# Altium schematic sheet RaspComputeModule_4_IO.SchDoc
size A1
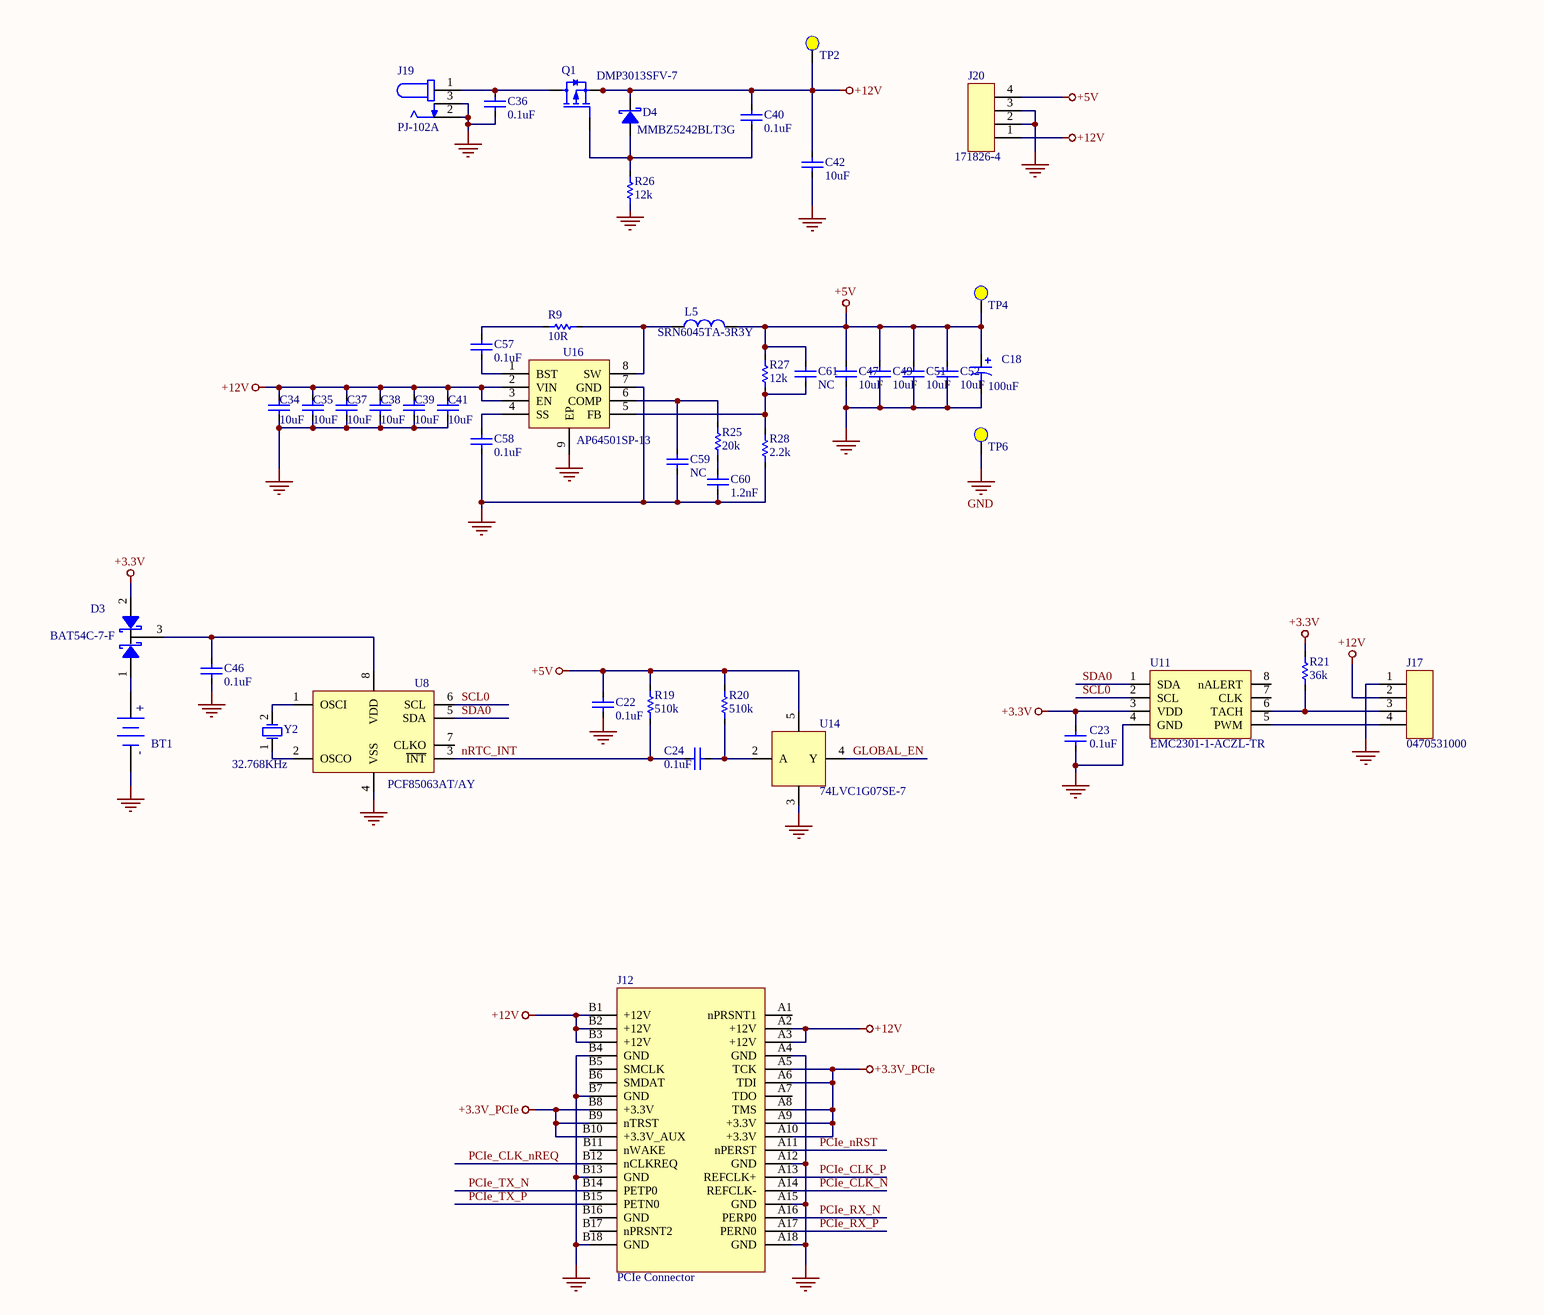
[diagram p0: RaspComputeModule_4_IO.SchDoc, top left]
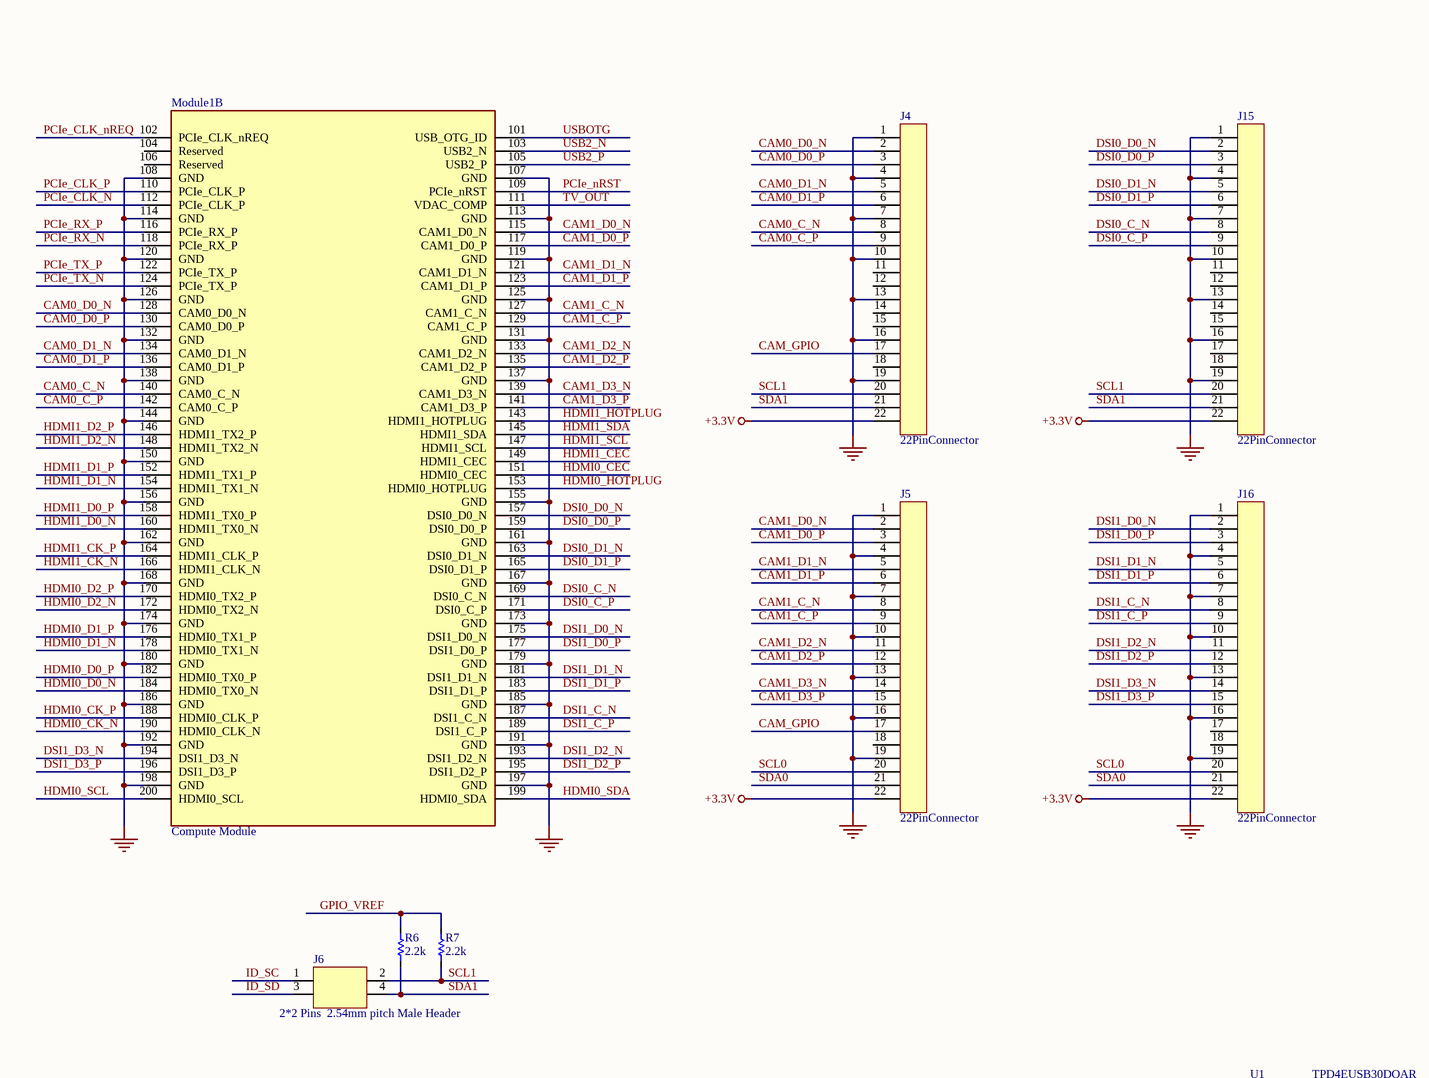
[diagram p1: RaspComputeModule_4_IO.SchDoc, top right]
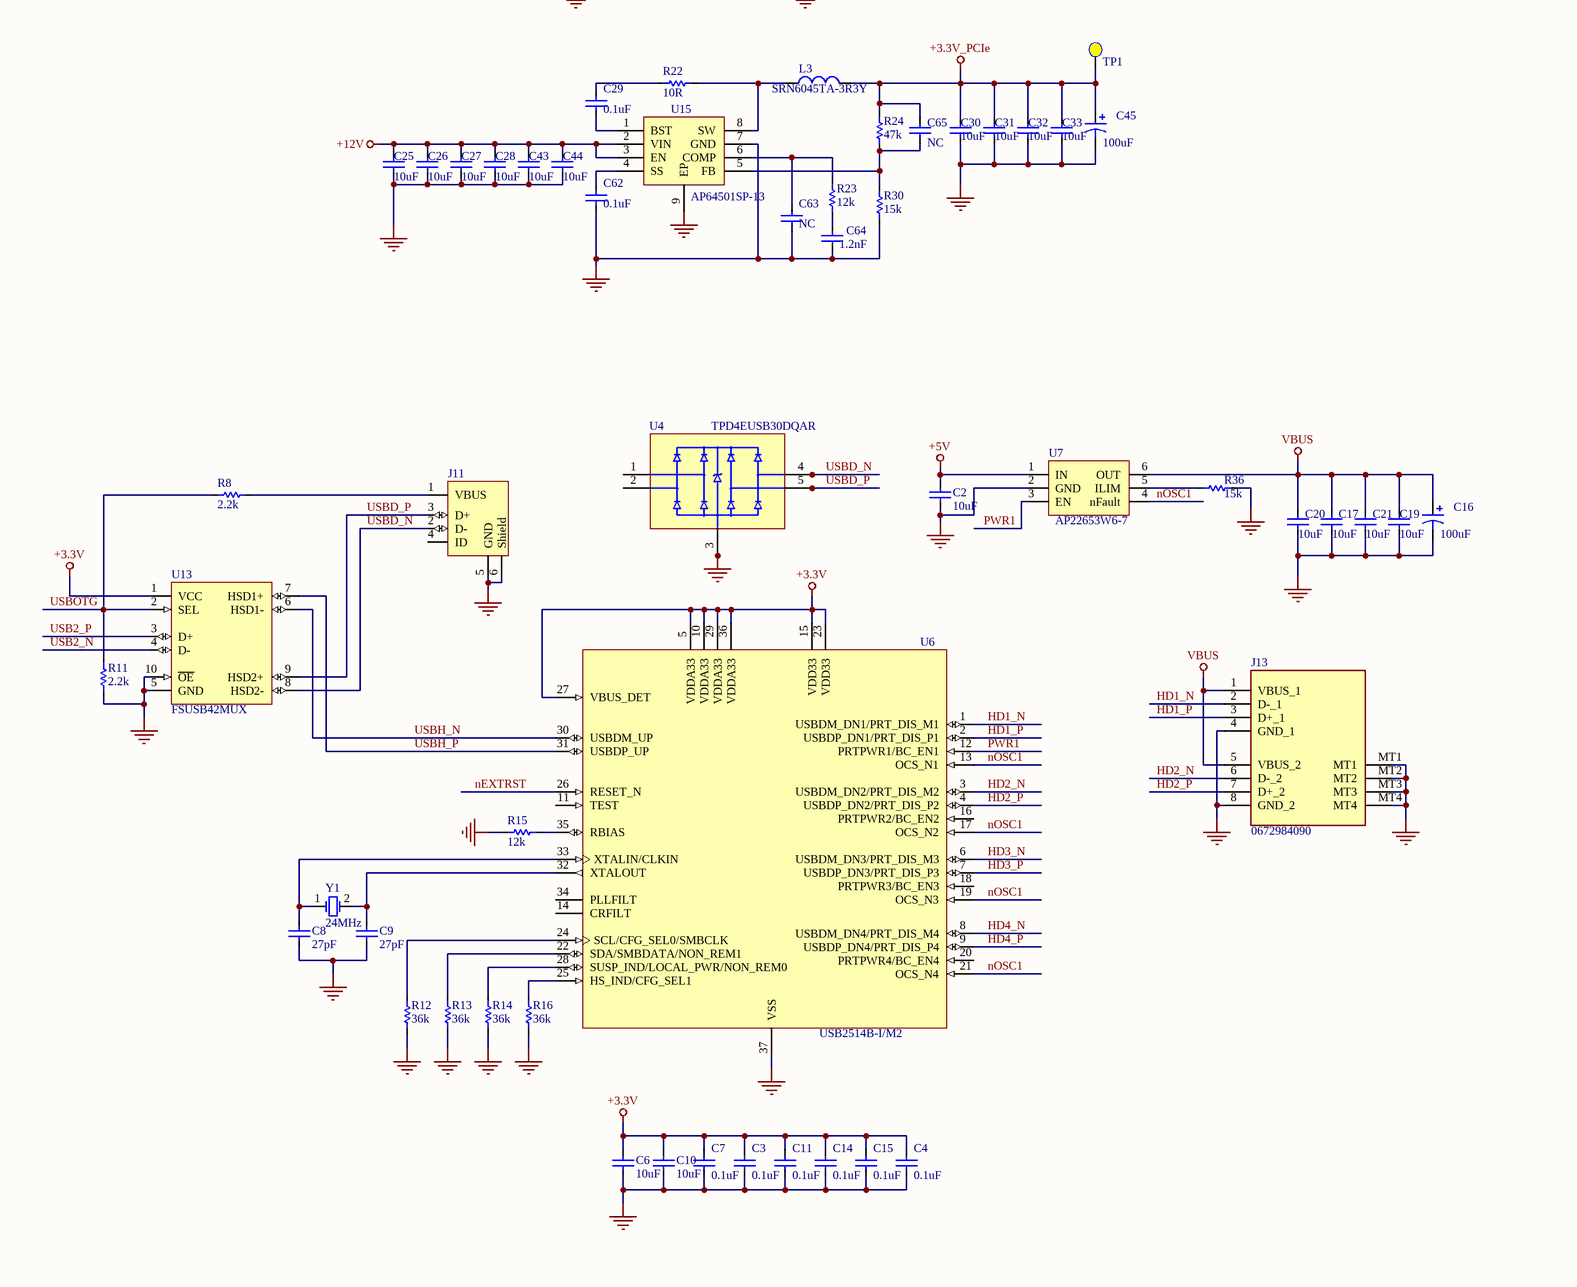
[diagram p2: RaspComputeModule_4_IO.SchDoc, bottom left]
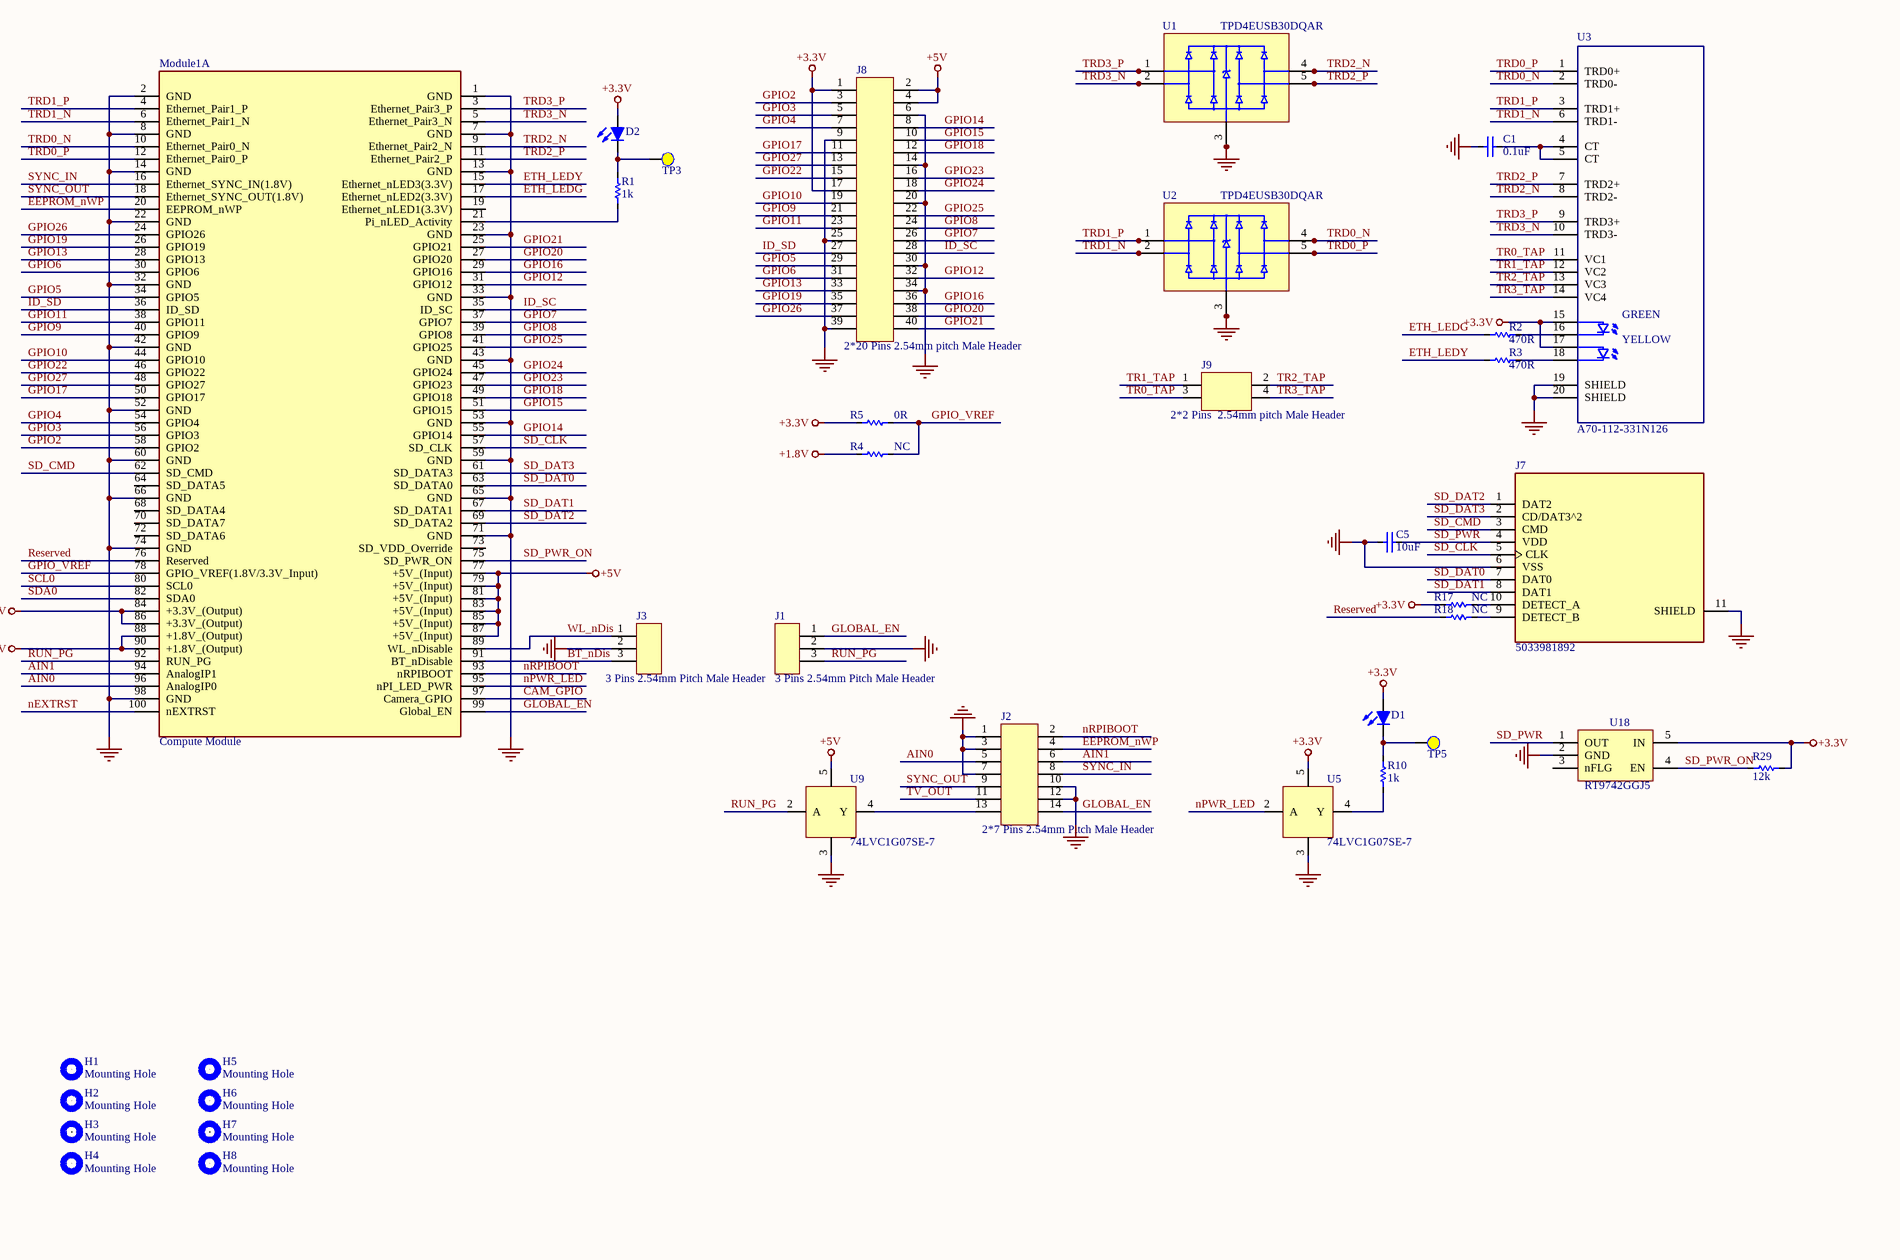
[diagram p3: RaspComputeModule_4_IO.SchDoc, bottom right]

## Parts
BT1  3034  [BatteryHolder_Keystone_3034_1x20mm]  (value not drawn)
C1  0.1uF  [C_0402_1005Metric]
C2  10uF  [C_0805_2012Metric]
C3  0.1uF  [C_0402_1005Metric]
C4  0.1uF  [C_0402_1005Metric]
C5  10uF  [C_0805_2012Metric]
C6  10uF  [C_0805_2012Metric]
C7  0.1uF  [C_0402_1005Metric]
C8  27pF  [C_0402_1005Metric]
C9  27pF  [C_0402_1005Metric]
C10  10uF  [C_0805_2012Metric]
C11  0.1uF  [C_0402_1005Metric]
C14  0.1uF  [C_0402_1005Metric]
C15  0.1uF  [C_0402_1005Metric]
C16  100uF  [CP_EIA-7343-31_Kemet-D]
C17  10uF  [C_0805_2012Metric]
C18  100uF  [CP_EIA-7343-31_Kemet-D]
C19  10uF  [C_0805_2012Metric]
C20  10uF  [C_0805_2012Metric]
C21  10uF  [C_0805_2012Metric]
C22  0.1uF  [C_0402_1005Metric]
C23  0.1uF  [C_0402_1005Metric]
C24  0.1uF  [C_0402_1005Metric]
C25  10uF  [C_0805_2012Metric]
C26  10uF  [C_0805_2012Metric]
C27  10uF  [C_0805_2012Metric]
C28  10uF  [C_0805_2012Metric]
C29  0.1uF  [C_0402_1005Metric]
C30  10uF  [C_0805_2012Metric]
C31  10uF  [C_0805_2012Metric]
C32  10uF  [C_0805_2012Metric]
C33  10uF  [C_0805_2012Metric]
C34  10uF  [C_0805_2012Metric]
C35  10uF  [C_0805_2012Metric]
C36  0.1uF  [C_0402_1005Metric]
C37  10uF  [C_0805_2012Metric]
C38  10uF  [C_0805_2012Metric]
C39  10uF  [C_0805_2012Metric]
C40  0.1uF  [C_0402_1005Metric]
C41  10uF  [C_0805_2012Metric]
C42  10uF  [C_0805_2012Metric]
C43  10uF  [C_0805_2012Metric]
C44  10uF  [C_0805_2012Metric]
C45  100uF  [CP_EIA-7343-31_Kemet-D]
C46  0.1uF  [C_0402_1005Metric]
C47  10uF  [C_0805_2012Metric]
C49  10uF  [C_0805_2012Metric]
C51  10uF  [C_0805_2012Metric]
C52  10uF  [C_0805_2012Metric]
C57  0.1uF  [C_0402_1005Metric]
C58  0.1uF  [C_0402_1005Metric]
C59  NC  [C_0402_1005Metric]
C60  1.2nF  [C_0402_1005Metric]
C61  NC  [C_0402_1005Metric]
C62  0.1uF  [C_0402_1005Metric]
C63  NC  [C_0402_1005Metric]
C64  1.2nF  [C_0402_1005Metric]
C65  NC  [C_0402_1005Metric]
D1  SML-D12U1WT86  [LED_0603_1608Metric]  (value not drawn)
D2  SML-D12U1WT86  [LED_0603_1608Metric]  (value not drawn)
D3  BAT54C-7-F  [SOT-23]
D4  MMBZ5242BLT3G  [D_SOT-23_ANK]
H1  Mounting Hole  [MountingHole_2.7mm_M2.5]
H2  Mounting Hole  [MountingHole_2.7mm_M2.5]
H3  Mounting Hole  [MountingHole_2.7mm_M2.5]
H4  Mounting Hole  [MountingHole_2.7mm_M2.5]
H5  Mounting Hole  [MountingHole_2.7mm_M2.5]
H6  Mounting Hole  [MountingHole_2.7mm_M2.5]
H7  Mounting Hole  [MountingHole_2.7mm_M2.5]
H8  Mounting Hole  [MountingHole_2.7mm_M2.5]
J1  3 Pins 2.54mm Pitch Male Header  [PinHeader_1x03_P2.54mm_Vertical]
J2  2*7 Pins 2.54mm Pitch Male Header  [PinHeader_2x07_P2.54mm_Vertical]
J3  3 Pins 2.54mm Pitch Male Header  [PinHeader_1x03_P2.54mm_Vertical]
J4  22PinConnector  [Hirose_FH12-22S-0.5SH_1x22-1MP_P0.50mm_Horizontal]
J5  22PinConnector  [Hirose_FH12-22S-0.5SH_1x22-1MP_P0.50mm_Horizontal]
J6  2*2 Pins  2.54mm pitch Male Header  [PinHeader_2x02_P2.54mm_Vertical]
J7  5033981892  [SDCARD_MOLEX_503398-1892]
J8  2*20 Pins 2.54mm pitch Male Header  [PinHeader_2x20_P2.54mm_Vertical]
J9  2*2 Pins  2.54mm pitch Male Header  [PinHeader_2x02_P2.54mm_Vertical]
J11  10118194-0001LF  [10118194-0001LF]  (value not drawn)
J12  PCIe Connector  [PCIex1-36]
J13  0672984090  [MOLEX_USB_67298-4090]
J15  22PinConnector  [Hirose_FH12-22S-0.5SH_1x22-1MP_P0.50mm_Horizontal]
J16  22PinConnector  [Hirose_FH12-22S-0.5SH_1x22-1MP_P0.50mm_Horizontal]
J17  0470531000  [FanPinHeader_1x04_P2.54mm_Vertical]
J19  PJ-102A  [CUI_PJ-102A]
J20  171826-4  [TE_171826-4]
L3  SRN6045TA-3R3Y  [L_Bourns_SRN6045TA]
L5  SRN6045TA-3R3Y  [L_Bourns_SRN6045TA]
Module1  Compute Module  [Raspberry-Pi-4-Compute-Module]  (parts A,B of 2)
Q1  DMP3013SFV-7  [Diodes_PowerDI3333-8]
R1  1k  [R_0402_1005Metric]
R2  470R  [R_0402_1005Metric]
R3  470R  [R_0402_1005Metric]
R4  NC  [R_0402_1005Metric]
R5  0R  [R_0402_1005Metric]
R6  2.2k  [R_0402_1005Metric]
R7  2.2k  [R_0402_1005Metric]
R8  2.2k  [R_0402_1005Metric]
R9  10R  [R_0402_1005Metric]
R10  1k  [R_0402_1005Metric]
R11  2.2k  [R_0402_1005Metric]
R12  36k  [R_0402_1005Metric]
R13  36k  [R_0402_1005Metric]
R14  36k  [R_0402_1005Metric]
R15  12k  [R_0402_1005Metric]
R16  36k  [R_0402_1005Metric]
R17  NC  [R_0402_1005Metric]
R18  NC  [R_0402_1005Metric]
R19  510k  [R_0402_1005Metric]
R20  510k  [R_0402_1005Metric]
R21  36k  [R_0402_1005Metric]
R22  10R  [R_0402_1005Metric]
R23  12k  [R_0402_1005Metric]
R24  47k  [R_0402_1005Metric]
R25  20k  [R_0402_1005Metric]
R26  12k  [R_0402_1005Metric]
R27  12k  [R_0402_1005Metric]
R28  2.2k  [R_0402_1005Metric]
R29  12k  [R_0402_1005Metric]
R30  15k  [R_0402_1005Metric]
R36  15k  [R_0402_1005Metric]
TP1  testpoint  [TestPoint_Pad_2.0x2.0mm]  (value not drawn)
TP2  testpoint  [TestPoint_Pad_2.0x2.0mm]  (value not drawn)
TP3  testpoint  [TestPoint_Pad_2.0x2.0mm]  (value not drawn)
TP4  testpoint  [TestPoint_Pad_2.0x2.0mm]  (value not drawn)
TP5  testpoint  [TestPoint_Pad_2.0x2.0mm]  (value not drawn)
TP6  testpoint  [TestPoint_Pad_2.0x2.0mm]  (value not drawn)
U1  TPD4EUSB30DQAR  [USON-10_2.5x1.0mm_P0.5mm]
U2  TPD4EUSB30DQAR  [USON-10_2.5x1.0mm_P0.5mm]
U3  A70-112-331N126  [TRJG0926HENL]
U4  TPD4EUSB30DQAR  [USON-10_2.5x1.0mm_P0.5mm]
U5  74LVC1G07SE-7  [SOT-353_SC-70-5]
U6  USB2514B-I/M2  [QFN-36-1EP_6x6mm_P0.5mm_EP3.7x3.7mm]
U7  AP22653W6-7  [SOT-23-6]
U8  PCF85063AT/AY  [SOIC-8_3.9x4.9mm_P1.27mm]
U9  74LVC1G07SE-7  [SOT-353_SC-70-5]
U11  EMC2301-1-ACZL-TR  [MSOP-8_3x3mm_P0.65mm]
U13  FSUSB42MUX  [MSOP-10_3x3mm_P0.5mm]
U14  74LVC1G07SE-7  [SOT-353_SC-70-5]
U15  AP64501SP-13  [SOIC-8-1EP_3.9x4.9mm_P1.27mm_EP2.95x4.9mm_Mask2.71x3.4mm_ThermalVias]
U16  AP64501SP-13  [SOIC-8-1EP_3.9x4.9mm_P1.27mm_EP2.95x4.9mm_Mask2.71x3.4mm_ThermalVias]
U18  RT9742GGJ5  [SOT-23-5]
Y1  24MHz  [Crystal_SMD_HC49-SD]
Y2  32.768KHz  [Crystal_SMD_3215-2Pin_3.2x1.5mm]

## Nets
+1.8V: Module1.88(+1.8V_(Output)) Module1.90(+1.8V_(Output)) R4.1
+3.3V: C3.1 C4.1 C6.1 C7.1 C10.1 C11.1 C14.1 C15.1 C23.1 D1.2(A) D2.2(A) D3.2 J4.22 J5.22 J8.1 J8.17 J15.22 J16.22 Module1.84(+3.3V_(Output)) Module1.86(+3.3V_(Output)) R5.1 R17.1 R21.2 R29.1 U3.15(G_A) U3.17(Y_A) U5.5(VCC) U6.5(VDDA33) U6.10(VDDA33) U6.15(VDD33) U6.23(VDD33) U6.27(VBUS_DET) U6.29(VDDA33) U6.36(VDDA33) U11.3(VDD) U13.1(VCC) U18.5(IN)
+3.3V_PCIe: C30.1 C31.1 C32.1 C33.1 C45.1 C65.1 J12.A5(TCK) J12.A6(TDI) J12.A8(TMS) J12.A9(+3.3V) J12.A10(+3.3V) J12.B8(+3.3V) J12.B9(nTRST) J12.B10(+3.3V_AUX) L3.2 R24.1 TP1.1
+5V: C2.1 C18.1 C22.1 C47.1 C49.1 C51.1 C52.1 C61.1 J8.2 J8.4 J20.4 L5.2 Module1.77(+5V_(Input)) Module1.79(+5V_(Input)) Module1.81(+5V_(Input)) Module1.83(+5V_(Input)) Module1.85(+5V_(Input)) Module1.87(+5V_(Input)) R19.2 R20.2 R27.1 TP4.1 U7.1(IN) U9.5(VCC) U14.5(VCC)
+12V: C25.1 C26.1 C27.1 C28.1 C34.1 C35.1 C37.1 C38.1 C39.1 C40.1 C41.1 C42.1 C43.1 C44.1 D4.1(K) J12.A2(+12V) J12.A3(+12V) J12.B1(+12V) J12.B2(+12V) J12.B3(+12V) J17.2 J20.1 Q1.1(S) Q1.2(S) Q1.3(S) TP2.1 U15.2(VIN) U15.3(EN) U16.2(VIN) U16.3(EN)
GND: BT1.2(-) C1.2 C2.2 C3.2 C4.2 C5.2 C6.2 C7.2 C8.2 C9.2 C10.2 C11.2 C14.2 C15.2 C16.2 C17.2 C18.2 C19.2 C20.2 C21.2 C22.2 C23.2 C25.2 C26.2 C27.2 C28.2 C30.2 C31.2 C32.2 C33.2 C34.2 C35.2 C36.2 C37.2 C38.2 C39.2 C41.2 C42.2 C43.2 C44.2 C45.2 C46.2 C47.2 C49.2 C51.2 C52.2 C58.2 C59.2 C60.2 C62.2 C63.2 C64.2 J1.2 J2.1 J2.3 J2.7 J2.10 J2.12 J3.2 J4.1 J4.4 J4.7 J4.10 J4.13 J4.16 J4.19 J5.1 J5.4 J5.7 J5.10 J5.13 J5.16 J5.19 J7.6(VSS) J7.11(SHIELD) J8.6 J8.9 J8.14 J8.20 J8.25 J8.30 J8.34 J8.39 J11.5(GND) J11.6(Shield) J12.A4(GND) J12.A12(GND) J12.A15(GND) J12.A18(GND) J12.B4(GND) J12.B7(GND) J12.B13(GND) J12.B18(GND) J13.4(GND_1) J13.8(GND_2) J13.MT1 J13.MT2 J13.MT3 J13.MT4 J15.1 J15.4 J15.7 J15.10 J15.13 J15.16 J15.19 J16.1 J16.4 J16.7 J16.10 J16.13 J16.16 J16.19 J17.1 J19.2 J19.3 J20.2 J20.3 Module1.1(GND) Module1.2(GND) Module1.7(GND) Module1.8(GND) Module1.13(GND) Module1.14(GND) Module1.22(GND) Module1.23(GND) Module1.32(GND) Module1.33(GND) Module1.42(GND) Module1.43(GND) Module1.52(GND) Module1.53(GND) Module1.59(GND) Module1.60(GND) Module1.65(GND) Module1.66(GND) Module1.71(GND) Module1.74(GND) Module1.98(GND) Module1.107(GND) Module1.108(GND) Module1.113(GND) Module1.114(GND) Module1.119(GND) Module1.120(GND) Module1.125(GND) Module1.126(GND) Module1.131(GND) Module1.132(GND) Module1.137(GND) Module1.138(GND) Module1.144(GND) Module1.150(GND) Module1.155(GND) Module1.156(GND) Module1.161(GND) Module1.162(GND) Module1.167(GND) Module1.168(GND) Module1.173(GND) Module1.174(GND) Module1.179(GND) Module1.180(GND) Module1.185(GND) Module1.186(GND) Module1.191(GND) Module1.192(GND) Module1.197(GND) Module1.198(GND) R11.2 R12.2 R13.2 R14.2 R15.1 R16.2 R26.2 R28.2 R30.2 R36.2 TP6.1 U1.3(GND_3) U1.8(GND_8) U2.3(GND_3) U2.8(GND_8) U3.19(SHIELD) U3.20(SHIELD) U4.3(GND_3) U4.8(GND_8) U5.3(GND) U6.37(VSS) U7.2(GND) U8.4(VSS) U9.3(GND) U11.4(GND) U13.5(GND) U13.10(~{OE}) U14.3(GND) U15.7(GND) U15.9(EP) U16.7(GND) U16.9(EP) U18.2(GND)
VBUS: C16.1 C17.1 C19.1 C20.1 C21.1 J13.1(VBUS_1) J13.5(VBUS_2) U7.6(OUT)
AIN0: J2.5 Module1.96(AnalogIP0)
AIN1: J2.6 Module1.94(AnalogIP1)
BT_nDis: J3.3 Module1.91(BT_nDisable)
CAM0_C_N: J4.8 Module1.140(CAM0_C_N)
CAM0_C_P: J4.9 Module1.142(CAM0_C_P)
CAM0_D0_N: J4.2 Module1.128(CAM0_D0_N)
CAM0_D0_P: J4.3 Module1.130(CAM0_D0_P)
CAM0_D1_N: J4.5 Module1.134(CAM0_D1_N)
CAM0_D1_P: J4.6 Module1.136(CAM0_D1_P)
CAM1_C_N: J5.8 Module1.127(CAM1_C_N)
CAM1_C_P: J5.9 Module1.129(CAM1_C_P)
CAM1_D0_N: J5.2 Module1.115(CAM1_D0_N)
CAM1_D0_P: J5.3 Module1.117(CAM1_D0_P)
CAM1_D1_N: J5.5 Module1.121(CAM1_D1_N)
CAM1_D1_P: J5.6 Module1.123(CAM1_D1_P)
CAM1_D2_N: J5.11 Module1.133(CAM1_D2_N)
CAM1_D2_P: J5.12 Module1.135(CAM1_D2_P)
CAM1_D3_N: J5.14 Module1.139(CAM1_D3_N)
CAM1_D3_P: J5.15 Module1.141(CAM1_D3_P)
CAM_GPIO: J4.17 J5.17 Module1.97(Camera_GPIO)
DSI0_C_N: J15.8 Module1.169(DSI0_C_N)
DSI0_C_P: J15.9 Module1.171(DSI0_C_P)
DSI0_D0_N: J15.2 Module1.157(DSI0_D0_N)
DSI0_D0_P: J15.3 Module1.159(DSI0_D0_P)
DSI0_D1_N: J15.5 Module1.163(DSI0_D1_N)
DSI0_D1_P: J15.6 Module1.165(DSI0_D1_P)
DSI1_C_N: J16.8 Module1.187(DSI1_C_N)
DSI1_C_P: J16.9 Module1.189(DSI1_C_P)
DSI1_D0_N: J16.2 Module1.175(DSI1_D0_N)
DSI1_D0_P: J16.3 Module1.177(DSI1_D0_P)
DSI1_D1_N: J16.5 Module1.181(DSI1_D1_N)
DSI1_D1_P: J16.6 Module1.183(DSI1_D1_P)
DSI1_D2_N: J16.11 Module1.193(DSI1_D2_N)
DSI1_D2_P: J16.12 Module1.195(DSI1_D2_P)
DSI1_D3_N: J16.14 Module1.194(DSI1_D3_N)
DSI1_D3_P: J16.15 Module1.196(DSI1_D3_P)
EEPROM_nWP: J2.4 Module1.20(EEPROM_nWP)
ETH_LEDG: Module1.17(Ethernet_nLED2(3.3V)) R2.2
ETH_LEDY: Module1.15(Ethernet_nLED3(3.3V)) R3.2
GLOBAL_EN: J1.1 J2.14 Module1.99(Global_EN) U14.4(Y)
GPIO2: J8.3 Module1.58(GPIO2)
GPIO3: J8.5 Module1.56(GPIO3)
GPIO4: J8.7 Module1.54(GPIO4)
GPIO5: J8.29 Module1.34(GPIO5)
GPIO6: J8.31 Module1.30(GPIO6)
GPIO7: J8.26 Module1.37(GPIO7)
GPIO8: J8.24 Module1.39(GPIO8)
GPIO9: J8.21 Module1.40(GPIO9)
GPIO10: J8.19 Module1.44(GPIO10)
GPIO11: J8.23 Module1.38(GPIO11)
GPIO12: J8.32 Module1.31(GPIO12)
GPIO13: J8.33 Module1.28(GPIO13)
GPIO14: J8.8 Module1.55(GPIO14)
GPIO15: J8.10 Module1.51(GPIO15)
GPIO16: J8.36 Module1.29(GPIO16)
GPIO17: J8.11 Module1.50(GPIO17)
GPIO18: J8.12 Module1.49(GPIO18)
GPIO19: J8.35 Module1.26(GPIO19)
GPIO20: J8.38 Module1.27(GPIO20)
GPIO21: J8.40 Module1.25(GPIO21)
GPIO22: J8.15 Module1.46(GPIO22)
GPIO23: J8.16 Module1.47(GPIO23)
GPIO24: J8.18 Module1.45(GPIO24)
GPIO25: J8.22 Module1.41(GPIO25)
GPIO26: J8.37 Module1.24(GPIO26)
GPIO27: J8.13 Module1.48(GPIO27)
GPIO_VREF: Module1.78(GPIO_VREF(1.8V/3.3V_Input)) R4.2 R5.2 R6.1 R7.1
HD1_N: J13.2(D-_1) U6.1(USBDM_DN1/PRT_DIS_M1)
HD1_P: J13.3(D+_1) U6.2(USBDP_DN1/PRT_DIS_P1)
HD2_N: J13.6(D-_2) U6.3(USBDM_DN2/PRT_DIS_M2)
HD2_P: J13.7(D+_2) U6.4(USBDP_DN2/PRT_DIS_P2)
HD3_N: U6.6(USBDM_DN3/PRT_DIS_M3)
HD3_P: U6.7(USBDP_DN3/PRT_DIS_P3)
HD4_N: U6.8(USBDM_DN4/PRT_DIS_M4)
HD4_P: U6.9(USBDP_DN4/PRT_DIS_P4)
HDMI0_CEC: Module1.151(HDMI0_CEC)
HDMI0_CK_N: Module1.190(HDMI0_CLK_N)
HDMI0_CK_P: Module1.188(HDMI0_CLK_P)
HDMI0_D0_N: Module1.184(HDMI0_TX0_N)
HDMI0_D0_P: Module1.182(HDMI0_TX0_P)
HDMI0_D1_N: Module1.178(HDMI0_TX1_N)
HDMI0_D1_P: Module1.176(HDMI0_TX1_P)
HDMI0_D2_N: Module1.172(HDMI0_TX2_N)
HDMI0_D2_P: Module1.170(HDMI0_TX2_P)
HDMI0_HOTPLUG: Module1.153(HDMI0_HOTPLUG)
HDMI0_SCL: Module1.200(HDMI0_SCL)
HDMI0_SDA: Module1.199(HDMI0_SDA)
HDMI1_CEC: Module1.149(HDMI1_CEC)
HDMI1_CK_N: Module1.166(HDMI1_CLK_N)
HDMI1_CK_P: Module1.164(HDMI1_CLK_P)
HDMI1_D0_N: Module1.160(HDMI1_TX0_N)
HDMI1_D0_P: Module1.158(HDMI1_TX0_P)
HDMI1_D1_N: Module1.154(HDMI1_TX1_N)
HDMI1_D1_P: Module1.152(HDMI1_TX1_P)
HDMI1_D2_N: Module1.148(HDMI1_TX2_N)
HDMI1_D2_P: Module1.146(HDMI1_TX2_P)
HDMI1_HOTPLUG: Module1.143(HDMI1_HOTPLUG)
HDMI1_SCL: Module1.147(HDMI1_SCL)
HDMI1_SDA: Module1.145(HDMI1_SDA)
ID_SC: J6.1 J8.28 Module1.35(ID_SC)
ID_SD: J6.3 J8.27 Module1.36(ID_SD)
nEXTRST: Module1.100(nEXTRST) U6.26(RESET_N)
nOSC1: U6.13(OCS_N1) U6.17(OCS_N2) U6.19(OCS_N3) U6.21(OCS_N4) U7.4(nFault)
nPWR_LED: Module1.95(nPI_LED_PWR) U5.2(A)
nRPIBOOT: J2.2 Module1.93(nRPIBOOT)
nRTC_INT: C24.2 R19.1 U8.3(~{INT})
PCIe_CLK_N: J12.A14(REFCLK-) Module1.112(PCIe_CLK_P)
PCIe_CLK_nREQ: J12.B12(nCLKREQ) Module1.102(PCIe_CLK_nREQ)
PCIe_CLK_P: J12.A13(REFCLK+) Module1.110(PCIe_CLK_P)
PCIe_nRST: J12.A11(nPERST) Module1.109(PCIe_nRST)
PCIe_RX_N: J12.A16(PERP0) Module1.118(PCIe_RX_P)
PCIe_RX_P: J12.A17(PERN0) Module1.116(PCIe_RX_P)
PCIe_TX_N: J12.B14(PETP0) Module1.124(PCIe_TX_P)
PCIe_TX_P: J12.B15(PETN0) Module1.122(PCIe_TX_P)
PWR1: U6.12(PRTPWR1/BC_EN1) U7.3(EN)
Reserved: Module1.76(Reserved) R18.1
RUN_PG: J1.3 Module1.92(RUN_PG) U9.2(A)
SCL0: J5.20 J16.20 Module1.80(SCL0) U8.6(SCL) U11.2(SCL)
SCL1: J4.20 J6.2 J15.20 R7.2
SD_CLK: J7.5(CLK) Module1.57(SD_CLK)
SD_CMD: J7.3(CMD) Module1.62(SD_CMD)
SD_DAT0: J7.7(DAT0) Module1.63(SD_DATA0)
SD_DAT1: J7.8(DAT1) Module1.67(SD_DATA1)
SD_DAT2: J7.1(DAT2) Module1.69(SD_DATA2)
SD_DAT3: J7.2(CD/DAT3^2) Module1.61(SD_DATA3)
SD_PWR: C5.1 J7.4(VDD) U18.1(OUT)
SD_PWR_ON: Module1.75(SD_PWR_ON) R29.2 U18.4(EN)
SDA0: J5.21 J16.21 Module1.82(SDA0) U8.5(SDA) U11.1(SDA)
SDA1: J4.21 J6.4 J15.21 R6.2
SYNC_IN: J2.8 Module1.16(Ethernet_SYNC_IN(1.8V))
SYNC_OUT: J2.9 Module1.18(Ethernet_SYNC_OUT(1.8V))
TR0_TAP: J9.3 U3.11(VC1)
TR1_TAP: J9.1 U3.12(VC2)
TR2_TAP: J9.2 U3.13(VC3)
TR3_TAP: J9.4 U3.14(VC4)
TRD0_N: Module1.10(Ethernet_Pair0_N) U2.4(D2+) U2.7(NC_7) U3.2(TRD0-)
TRD0_P: Module1.12(Ethernet_Pair0_P) U2.5(D2-) U2.6(NC_6) U3.1(TRD0+)
TRD1_N: Module1.6(Ethernet_Pair1_N) U2.2(D1-) U2.9(NC_9) U3.6(TRD1-)
TRD1_P: Module1.4(Ethernet_Pair1_P) U2.1(D1+) U2.10(NC_10) U3.3(TRD1+)
TRD2_N: Module1.9(Ethernet_Pair2_N) U1.4(D2+) U1.7(NC_7) U3.8(TRD2-)
TRD2_P: Module1.11(Ethernet_Pair2_P) U1.5(D2-) U1.6(NC_6) U3.7(TRD2+)
TRD3_N: Module1.5(Ethernet_Pair3_N) U1.2(D1-) U1.9(NC_9) U3.10(TRD3-)
TRD3_P: Module1.3(Ethernet_Pair3_P) U1.1(D1+) U1.10(NC_10) U3.9(TRD3+)
TV_OUT: J2.11 Module1.111(VDAC_COMP)
USB2_N: Module1.103(USB2_N) U13.4(D-)
USB2_P: Module1.105(USB2_P) U13.3(D+)
USBD_N: J11.2(D-) U4.4(D2+) U4.7(NC_7) U13.8(HSD2-)
USBD_P: J11.3(D+) U4.5(D2-) U4.6(NC_6) U13.9(HSD2+)
USBH_N: U6.30(USBDM_UP) U13.6(HSD1-)
USBH_P: U6.31(USBDP_UP) U13.7(HSD1+)
USBOTG: Module1.101(USB_OTG_ID) R8.2 R11.1 U13.2(SEL)
WL_nDis: J3.1 Module1.89(WL_nDisable)
NetBT1_1: BT1.1(+) D3.1
NetC1_1: C1.1 U3.4(CT) U3.5(CT)
NetC8_1: C8.1 U6.33(XTALIN/CLKIN) Y1.1(OSC1)
NetC9_1: C9.1 U6.32(XTALOUT) Y1.2(OSC2)
NetC24_1: C24.1 R20.1 U14.2(A)
NetC29_1: C29.1 R22.2
NetC29_2: C29.2 U15.1(BST)
NetC36_1: C36.1 J19.1 Q1.5(D)
NetC40_2: C40.2 D4.2(A) Q1.4(G) R26.1
NetC46_1: C46.1 D3.3 U8.8(VDD)
NetC57_1: C57.1 R9.2
NetC57_2: C57.2 U16.1(BST)
NetC58_1: C58.1 U16.4(SS)
NetC59_1: C59.1 R25.1 U16.6(COMP)
NetC60_1: C60.1 R25.2
NetC61_2: C61.2 R27.2 R28.1 U16.5(FB)
NetC62_1: C62.1 U15.4(SS)
NetC63_1: C63.1 R23.1 U15.6(COMP)
NetC64_1: C64.1 R23.2
NetC65_2: C65.2 R24.2 R30.1 U15.5(FB)
NetD1_1: D1.1(K) R10.1 TP5.1
NetD2_1: D2.1(K) R1.1 TP3.1
NetJ2_13: J2.13 U9.4(Y)
NetJ7_9: J7.9(DETECT_B) R18.2
NetJ7_10: J7.10(DETECT_A) R17.2
NetJ11_1: J11.1(VBUS) R8.1
NetJ17_3: J17.3 R21.1 U11.6(TACH)
NetJ17_4: J17.4 U11.5(PWM)
NetL3_1: L3.1 R22.1 U15.8(SW)
NetL5_1: L5.1 R9.1 U16.8(SW)
NetModule1_21: Module1.21(Pi_nLED_Activity) R1.2
NetR2_1: R2.1 U3.16(G_K)
NetR3_1: R3.1 U3.18(Y_K)
NetR10_2: R10.2 U5.4(Y)
NetR12_1: R12.1 U6.24(SCL/CFG_SEL0/SMBCLK)
NetR13_1: R13.1 U6.22(SDA/SMBDATA/NON_REM1)
NetR14_1: R14.1 U6.28(SUSP_IND/LOCAL_PWR/NON_REM0)
NetR15_2: R15.2 U6.35(RBIAS)
NetR16_1: R16.1 U6.25(HS_IND/CFG_SEL1)
NetR36_1: R36.1 U7.5(ILIM)
NetU4_1: U4.1(D1+) U4.10(NC_10)
NetU4_2: U4.2(D1-) U4.9(NC_9)
NetU8_1: U8.1(OSCI) Y2.2(OSC2)
NetU8_2: U8.2(OSCO) Y2.1(OSC1)

Not connected (* = marked no-connect by the designer): H1 Un1; H2 Un1; H3 Un1; H4 Un1; H5 Un1; H6 Un1; H7 Un1; H8 Un1; J4 11 12 14 15 18; J5 18; J11 4(ID); J12 A1(nPRSNT1) A7(TDO) B5(SMCLK) B6(SMDAT) B11(nWAKE) B16(GND) B17(nPRSNT2); J15 11 12 14 15 17 18; J16 17 18; Module1 19(Ethernet_nLED1(3.3V)) 64(SD_DATA5) 68(SD_DATA4) 70(SD_DATA7) 72(SD_DATA6) 73(SD_VDD_Override) 104(Reserved) 106(Reserved); U6 11(TEST) 14(CRFILT) 16(PRTPWR2/BC_EN2) 18(PRTPWR3/BC_EN3) 20(PRTPWR4/BC_EN4) 34(PLLFILT); U8 7(CLKO); U11 7(CLK) 8(nALERT); U18 3(nFLG)

## Notes on the sheet
- (in symbol A70-112-331N126) GREEN; YELLOW

## Library data of the parts
BT1 = BATTERY_18650: BATTERY RETAINER COIN 20MM SMD; Manufacturer: Keystone Electronics; Manufacturer Part Number: 3034; Supplier: Digi-Key; Supplier Part Number: 36-3034-ND; Value: 3034
C1 C3 C4 C7 C11 C14 C15 C22-C24 C29 C36 C40 C46 C57 C58 C62 = Cap: 0.1µF ±10% 50V; Manufacturer: Yageo; Manufacturer Part Number: CC0402KRX5R9BB104; Supplier: Digi-Key; Supplier Part Number: 311-3342-1-ND; Value: 0.1uF
C2 C5 C6 C10 C17 C19-C21 C25-C28 C30-C35 C37-C39 C41-C44 C47 C49 C51 C52 = Cap: 10µF ±10% 35V; Manufacturer: Murata; Manufacturer Part Number: GRM21BR6YA106KE43L; Supplier: Digi-Key; Supplier Part Number: 490-10514-1-ND; Vaule: 10uF
C8 C9 = Cap: 27pF ±1% 50V; Manufacturer: Yageo; Manufacturer Part Number: CC0402FRNPO9BN270; Supplier: Digi-Key; Supplier Part Number: 311-1644-1-ND; Value: 27pF
C16 C18 C45 = Cap Pol1: CAP TANT 100UF 20% 10V 2917; Manufacturer Part Number: TAJD107M010RNJ; Manufacturer: AVX Corporation; Supplier: Digi-Key; Supplier Part Number: 478-3918-1-ND; Value: 100uF
C59 C61 C63 C65 = Cap: Value: NC
C60 C64 = Cap: 1200pF ±10% 50V; Manufacturer: Murata; Manufacturer Part Number: GRM155R71H122KA01J; Supplier: Digi-Key; Supplier Part Number: 490-6352-1-ND; Value: 1.2nF
D1 D2 = LED1: LED RED DIFFUSED 0603 SMD; Manufacturer: Rohm Semiconductor; Supplier: Digi-Key; Supplier Part Number: SML-D12U1WT86CT-ND; Manufacturer Part Number: SML-D12U1WT86; Value: SML-D12U1WT86
D3 = BAT54C-7-F: DIODE ARRAY SCHOTTKY 30V SOT323; Manufacturer: ON Semiconductor; Manufacturer Part Number: BAT54CWT1G; Value: BAT54C-7-F; Supplier Part Number: BAT54CWT1GOSCT-ND; Supplier: Digi-Key
D4 = Diode 10TQ035: DIODE ZENER 12V 225MW SOT23-3; Manufacturer: ON Semiconductor; Value: MMBZ5242BLT3G; Manufacturer Part Number: MMBZ5242BLT3G; Supplier: Digi-Key; Supplier Part Number: MMBZ5242BLT3GOSCT-ND
J1 J3 = 3PinConnector: Manufacturer: Any; Manufacturer Part Number: Any; Supplier: Any; Supplier Part Number: Any; Value: 3 Pins 2.54mm Pitch Male Header
J2 = 14PinConnector: Manufacturer: Any; Manufacturer Part Number: Any; Supplier: Any; Supplier Part Number: Any; Value: 2*7 Pins 2.54mm Pitch Male Header
J4 J5 J15 J16 = 22PinConnector: CONN FFC BOTTOM 22POS 0.50MM R/A; Manufacturer: Hirose Electric Co Ltd; Manufacturer Part Number: FH12-22S-0.5SH(55); Value: FH12-22S-0.5SH(55); Supplier: Digi-Key; Supplier Part Number: HFJ122CT-ND
J6 J9 = 2*2 Pin Header: Manufacuturer: Any; Manufactuer Part Number: Any; Supplier: Any; Supplier Part Number: Any; Value: 2*2 Pins  2.54mm pitch Male Header
J7 = 503398-1892: MICRO SD PUSH/PUSH NORMAL 1.28MM 8C; Manufacturer: Molex; Manufacturer Part Number: 5033981892; Supplier: Digi-Key; Supplier Part Number: WM11190CT-ND; Value: 5033981892
J8 = 40PinConnector: Manufacturer: Any; Manufacturer Part Number: Any; Supplier: Any; Supplier Part Number: Any; Value: 2*20 Pins 2.54mm pitch Male Header
J11 = 10118194-0001LF: CONN RCPT USB2.0 MICRO B SMD R/A; Manufacturer: Amphenol FCI; Supplier Part Number: 609-4618-1-ND; Manufacturer Part Number: 10118194-0001LF; Value: 10118194-0001LF; Supplier: Digi-Key
J12 = PCIe Connector: Manufacturer: Samtec; Manufacturer Part Number: PCIE-036-02-S-D-RA; Value: PCIE-036-02-S-D-RA; Supplier: Mouser; Supplier Part Number: 200-PCIE03602SDRA
J13 = Double USB Connector: CONN RCPT TYPEA STACKED 8POS R/A; Manufacturer: Molex; Manufacturer Part Number: 0672984090; Supplier: Digi-Key; Value: 0672984090; Supplier Part Number: WM17130-ND
J17 = 4PinConnector: Manufacturer: Molex; Manufacturer Part Number: 0470531000; Supplier: Digi-Key; Supplier Part Number: WM4330-ND; Value: 0470531000
J19 = PJ-102A: CONN PWR JACK 2X5.5MM SOLDER; Manufacturer: CUI Devices; Manufacturer Part Number: PJ-102A; Value: PJ-102A; Supplier: Digi-Key; Supplier Part Number: CP-102A-ND
J20 = 4PinConnector: CONN HEADER R/A 4POS 2.5MM; Manufacturer: TE Connectivity AMP Connectors; Manufacturer Part Number: 171826-4; Supplier: Digi-Key; Supplier Part Number: A112643-ND; Value: 171826-4
L3 L5 = Inductor: FIXED IND 3.3UH 5A 21 MOHM SMD; Manufacturer: Bourns Inc.; Manufacturer Part Number: SRN6045TA-3R3Y; Value: SRN6045TA-3R3Y; Supplier: Digi-Key; Supplier Part Number: SRN6045TA-3R3YCT-ND
Module1 = ComputeModule4: CONN RCPT 100POS SMD GOLD; Manufacturer: Hirose Electric Co Ltd; Manufacturer Part Number: DF40C-100DS-0.4V(51); Value: Compute Module; Supplier: Digi-Key; Supplier Part Number: H11615CT-ND
Q1 = DMP3013SFV-7: Manufacturer: Diodes Incorporated; Value: DMP3013SFV-7; Manufacturer Part Number: DMP3013SFV-7; Supplier: Digi-Key; Supplier Part Number: DMP3013SFV-7DICT-ND
R1 R10 = Res Semi: 1 kOhms ±1% 0.063W; Manufacturer: Yageo; Manufacturer Part Number: RC0402FR-071KL; Value: 1k; Supplier: Digi-Key; Supplier Part Number: 311-1.00KLRCT-ND
R2 R3 = Res Semi: 470 Ohms ±1% 0.063W; Manufacturer: Yageo; Manufacturer Part Number: RC0402FR-07470RL; Value: 470R; Supplier: Digi-Key; Supplier Part Number: 311-470LRCT-ND
R4 R17 R18 = Res Semi: Value: NC
R5 = Res Semi: 0 Ohms Jumper 0.063W; Manufacturer: Yageo; Manufacturer Part Number: RC0402FR-070RL; Value: 0R; Supplier: Digi-Key; Supplier Part Number: 311-0.0LRCT-ND
R6-R8 R11 R28 = Res Semi: 2.2 kOhms ±1% 0.063W; Manufacturer: Yageo; Manufacturer Part Number: RC0402FR-072K2L; Value: 2.2k; Supplier: Digi-Key; Supplier Part Number: 311-2.20KLRCT-ND
R9 R22 = Res Semi: 10 Ohms ±1% 0.063W; Manufacturer: Yageo; Manufacturer Part Number: RC0402FR-0710RL; Value: 10R; Supplier: Digi-Key; Supplier Part Number: 311-10.0LRCT-ND
R12-R14 R16 R21 = Res Semi: 36 kOhms ±1% 0.063W; Manufacturer: Yageo; Manufacturer Part Number: RC0402FR-0736KL; Value: 36k; Supplier: Digi-Key; Supplier Part Number: 311-36.0KLRCT-ND
R15 R23 R26 R27 R29 = Res Semi: 12 kOhms ±1% 0.063W; Manufacturer: Yageo; Manufacturer Part Number: RC0402FR-0712KL; Value: 12k; Supplier: Digi-Key; Supplier Part Number: 311-12.0KLRCT-ND
R19 R20 = Res Semi: 510 kOhms ±1% 0.063W; Manufacturer: Yageo; Manufacturer Part Number: RC0402FR-07510KL; Value: 510k; Supplier: Digi-Key; Supplier Part Number: 311-510KLRCT-ND
R24 = Res Semi: 47 kOhms ±1% 0.063W; Manufacturer: Yageo; Manufacturer Part Number: RC0402FR-0747KL; Value: 47k; Supplier: Digi-Key; Supplier Part Number: 311-47.0KLRCT-ND
R25 = Res Semi: 20 kOhms ±1% 0.063W; Manufacturer: Yageo; Manufacturer Part Number: RC0402FR-0720KL; Value: 20k; Supplier: Digi-Key; Supplier Part Number: 311-20.0KLRCT-ND
R30 R36 = Res Semi: 15 kOhms ±1% 0.063W; Manufacturer: Yageo; Manufacturer Part Number: RC0402FR-0715KL; Value: 15k; Supplier: Digi-Key; Supplier Part Number: 311-15.0KLRCT-ND
U1 U2 U4 = TPD4EUSB30DQAR: TVS DIODE 5.5V 8V 10USON; MF: Texas Instruments; Supplier Part Number: 296-28063-1-ND; Supplier: Digi-Key; MP: TPD4EUSB30DQAR; Value: TPD4EUSB30DQAR
U3 = A70-112-331N126: RJ45 MAGNETIC JACK WITH LED; Manufacturer: LINK-PP; Value: A70-112-331N126; Supplier: Any; Manufacturer Part Number: A70-112-331N126
U5 U9 U14 = 74LVC1G07SE-7: IC BUF NON-INVERT 5.5V SOT353; Manufacturer: Nexperia; Manufacturer Part Number: 74LVC1G07SE-7; Supplier: Diodes Incorporated; Supplier Part Number: 74LVC1G07SE-7DICT-ND; Value: 74LVC1G07SE-7
U6 = USB2514B-I/M2: USB Hub Controller USB Interface 36-SQFN _6x6_; Manufacturer: Microchip; Manufacturer Part Number: USB2514B-I/M2; Supplier Part Number: Digi-Key; Supplier: Digi-Key; Value: USB2514B-I/M2
U7 = AP22653W6-7: LOAD SWITCH,SOT26,T&R,3K; Manufacturer: Diodes Incorporated; Manufacturer Part Number: AP22653W6-7; Supplier: Digi-Key; Supplier Part Number: 31-AP22653W6-7CT-ND; Value: AP22653W6-7
U8 = PCF85063AT/AAZ: IC RTC CLK/CALENDAR I2C 8SOIC; Manufacturer: NXP USA Inc.; Manufacturer Part Number: PCF85063AT/AY; Supplier: Digi-Key; Supplier Part Number: 568-12403-1-ND; Value: PCF85063AT/AY
U11 = EMC2301-1-ACZL-TR: IC MOTOR DRIVER 3V-3.6V 8MSOP; Manufacturer: Microchip Technology; Manufacturer Part Number: EMC2301-1-ACZL-TR; Supplier: Digi-Key; Supplier Part Number: EMC2301-1-ACZL-CT-ND; Value: EMC2301-1-ACZL-TR
U13 = FSUSB42MUX: USB Switch IC 1 Channel 10-MSOP; Manufacturer: ON Semiconductor; Supplier Part Number: FSUSB42MUXCT-ND; Value: FSUSB42MUX; Supplier: Digi-Key; Manufacturer Part Number: FSUSB42MUX
U15 U16 = AP64501SP-13: DCDC CONV HV BUCK SO-8EP; Manufacturer: Diodes Incorporated; Manufacturer Part Number: AP64501SP-13; Supplier: Digi-Key; Supplier Part Number: 31-AP64501SP-13CT-ND; Value: AP64501SP-13
U18 = RT9742GGJ5: IC PWR SWTCH N-CHAN 1:1 TSOT23-5; Manufacturer: Richtek USA Inc.; Manufacturer Part Number: RT9742GGJ5; Supplier: Digi-Key; Supplier Part Number: 1028-1436-1-ND; Value: RT9742GGJ5
Y1 = (no symbol name): CRYSTAL 24.0000MHZ 20PF SMD; Manufacturer: ECS Inc.; Manufacturer Part Number: ECS-240-20-5PX-TR; Supplier: Digi-Key; Supplier Part Number: XC1255CT-ND; Value: 24MHz
Y2 = (no symbol name): CRYSTAL 32.7680KHZ 12.5PF SMD; Manufacturer: NDK America, Inc.; Manufacturer Part Number: NX3215SA-32.768K-STD-MUA-8; Supplier: Digi-Key; Supplier Part Number: 644-1156-1-ND; Value: 32.768KHz